# Altium schematic sheet CAP_RELEASE.SchDoc
size A; SheetNumber: 14; SheetTotal: 21
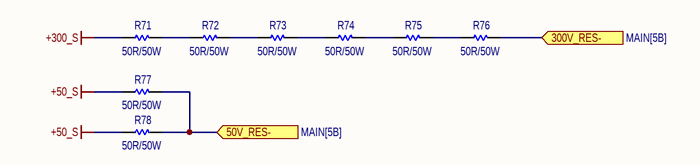
[diagram p0: CAP_RELEASE.SchDoc]

## Parts
R71  50R/50W  [TO263-123]
R72  50R/50W  [TO263-123]
R73  50R/50W  [TO263-123]
R74  50R/50W  [TO263-123]
R75  50R/50W  [TO263-123]
R76  50R/50W  [TO263-123]
R77  50R/50W  [TO263-123]
R78  50R/50W  [TO263-123]

## Ports
50V_RES- (in, see MAIN[5B]), 300V_RES- (in, see MAIN[5B])

## Nets
+50_S: R77.1 R78.1
+300_S: R71.1
50V_RES-: R77.2 R78.2 ; port 50V_RES-
300V_RES-: R76.2 ; port 300V_RES-
NetR71_2: R71.2 R72.1
NetR72_2: R72.2 R73.1
NetR73_2: R73.2 R74.1
NetR74_2: R74.2 R75.1
NetR75_2: R75.2 R76.1

## Library data of the parts
R71-R78 = Res-SMD: TPAN0263F50R0K9; pin to pad: 2>3; Manufacturer: Generic Components; Class: Passive; PN: TPAN0263F50R0K9; Publisher: Altium Hobart Technology Centre